# Altium schematic sheet 04-AUDIO.SchDoc
size C
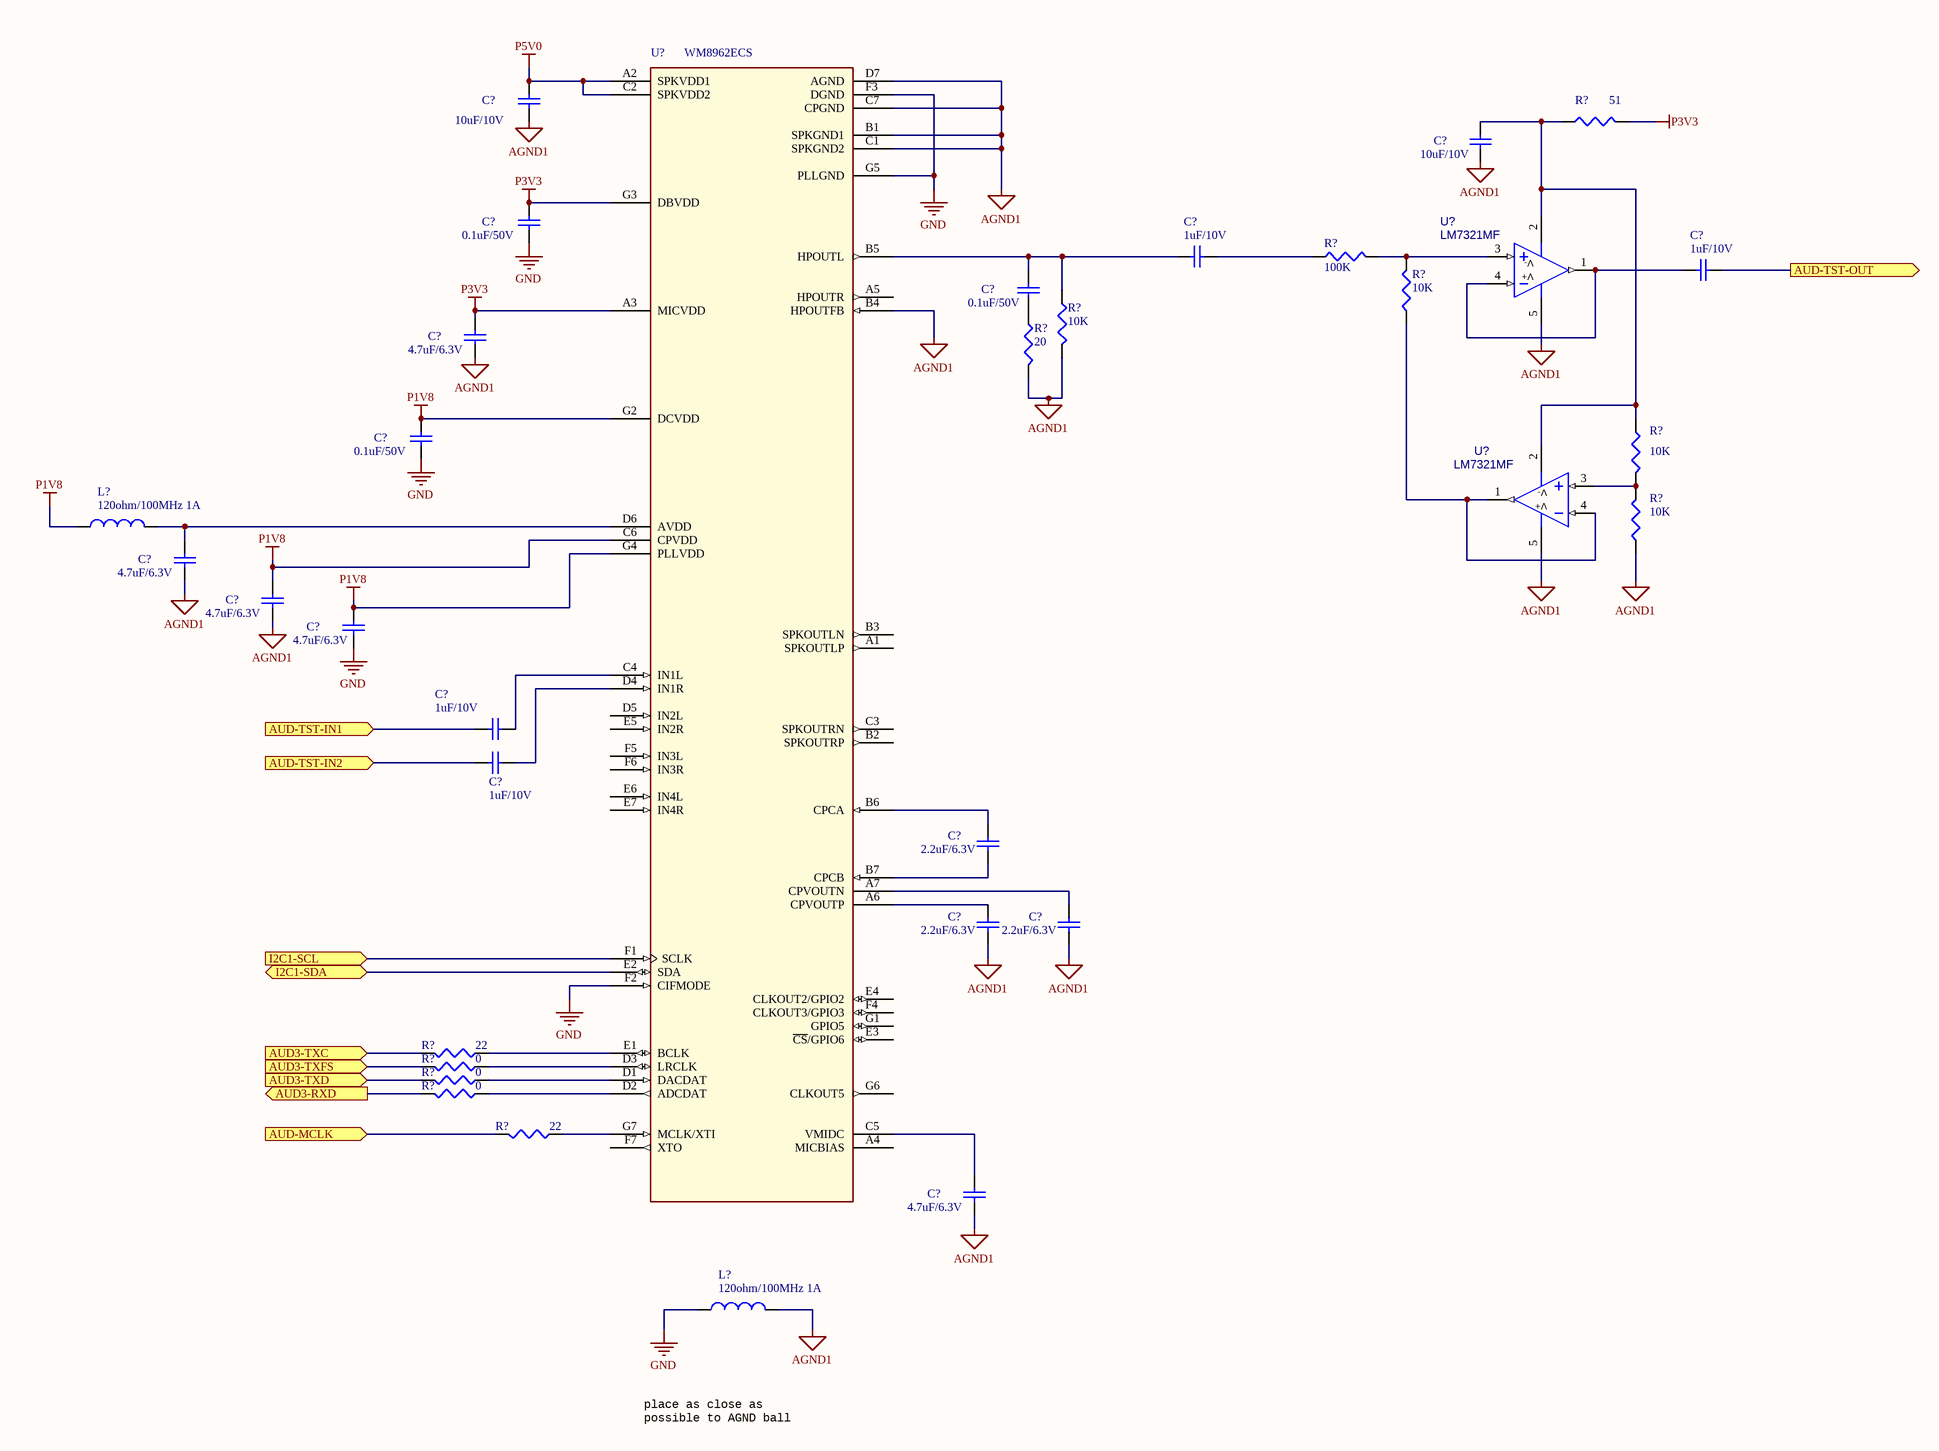
[diagram p0: 04-AUDIO.SchDoc]

## Parts
(Parts that share a designator on the sheet are numbered #1, #2 ... from top to bottom, then left to right.)
C?#1  10uF/10V  [0805]
C?#2  10uF/10V  [0805]
C?#3  0.1uF/50V  [0402]
C?#4  1uF/10V  [0402]
C?#5  1uF/10V  [0402]
C?#6  0.1uF/50V  [0402]
C?#7  4.7uF/6.3V  [0603]
C?#8  0.1uF/50V  [0402]
C?#9  4.7uF/6.3V  [0603]
C?#10  4.7uF/6.3V  [0603]
C?#11  4.7uF/6.3V  [0603]
C?#12  1uF/10V  [0402]
C?#13  1uF/10V  [0402]
C?#14  2.2uF/6.3V  [0402]
C?#15  2.2uF/6.3V  [0402]
C?#16  2.2uF/6.3V  [0402]
C?#17  4.7uF/6.3V  [0603]
L?#1  120ohm/100MHz 1A  [0603]
L?#2  120ohm/100MHz 1A  [0603]
R?#1  51  [0402]
R?#2  100K  [0402]
R?#3  10K  [0402]
R?#4  10K  [0402]
R?#5  20  [0402]
R?#6  10K  [0402]
R?#7  10K  [0402]
R?#8  22  [0402]
R?#9  0  [0402]
R?#10  0  [0402]
R?#11  0  [0402]
R?#12  22  [0402]
U?#1  WM8962ECS  [BGA49]
U?#2  LM7321MF  [SOT23-5]
U?#3  LM7321MF  [SOT23-5]

## Ports
AUD3-RXD (out), AUD3-TXC (in), AUD3-TXD (in), AUD3-TXFS (in), AUD-MCLK (in), AUD-TST-IN1 (in), AUD-TST-IN2 (in), AUD-TST-OUT (out), I2C1-SCL (in), I2C1-SDA (bidir)

## Nets
AGND1: C?#1.1 C?#2.2 C?#7.1 C?#9.1 C?#10.1 C?#15.1 C?#16.1 C?#17.1 L?#2.2 R?#3.2 R?#5.2 R?#7.1 U?#1.B1(SPKGND1) U?#1.B4(HPOUTFB) U?#1.C1(SPKGND2) U?#1.C7(CPGND) U?#1.D7(AGND) U?#2.5(V+) U?#3.5(V+)
GND: C?#3.1 C?#8.1 C?#11.1 L?#2.1 U?#1.F2(CIFMODE) U?#1.F3(DGND) U?#1.G5(PLLGND)
P1V8: C?#8.2 C?#10.2 C?#11.2 L?#1.1 U?#1.C6(CPVDD) U?#1.G2(DCVDD) U?#1.G4(PLLVDD)
P3V3: C?#3.2 C?#7.2 R?#1.2 U?#1.A3(MICVDD) U?#1.G3(DBVDD)
P5V0: C?#1.2 U?#1.A2(SPKVDD1) U?#1.C2(SPKVDD2)
AUD3-RXD: R?#11.2 ; port AUD3-RXD
AUD3-TXC: R?#8.2 ; port AUD3-TXC
AUD3-TXD: R?#10.2 ; port AUD3-TXD
AUD3-TXFS: R?#9.2 ; port AUD3-TXFS
AUD-MCLK: R?#12.2 ; port AUD-MCLK
AUD-TST-IN1: C?#12.2 ; port AUD-TST-IN1
AUD-TST-IN2: C?#13.2 ; port AUD-TST-IN2
AUD-TST-OUT: C?#5.1 ; port AUD-TST-OUT
I2C1-SCL: U?#1.F1(SCLK) ; port I2C1-SCL
I2C1-SDA: U?#1.E2(SDA) ; port I2C1-SDA
NetC?#2_1: C?#2.1 R?#1.1 R?#6.1 U?#2.2(V-) U?#3.2(V-)
NetC?#4_1: C?#4.1 R?#2.1
NetC?#4_2: C?#4.2 C?#6.2 R?#3.1 U?#1.B5(HPOUTL)
NetC?#5_2: C?#5.2 U?#2.1(OUT) U?#2.4(IN-)
NetC?#6_1: C?#6.1 R?#5.1
NetC?#9_2: C?#9.2 L?#1.2 U?#1.D6(AVDD)
NetC?#12_1: C?#12.1 U?#1.C4(IN1L)
NetC?#13_1: C?#13.1 U?#1.D4(IN1R)
NetC?#14_1: C?#14.1 U?#1.B7(CPCB)
NetC?#14_2: C?#14.2 U?#1.B6(CPCA)
NetC?#15_2: C?#15.2 U?#1.A6(CPVOUTP)
NetC?#16_2: C?#16.2 U?#1.A7(CPVOUTN)
NetC?#17_2: C?#17.2 U?#1.C5(VMIDC)
NetR?#2_2: R?#2.2 R?#4.2 U?#2.3(IN+)
NetR?#4_1: R?#4.1 U?#3.1(OUT) U?#3.4(IN-)
NetR?#6_2: R?#6.2 R?#7.2 U?#3.3(IN+)
NetR?#8_1: R?#8.1 U?#1.E1(BCLK)
NetR?#9_1: R?#9.1 U?#1.D3(LRCLK)
NetR?#10_1: R?#10.1 U?#1.D1(DACDAT)
NetR?#11_1: R?#11.1 U?#1.D2(ADCDAT)
NetR?#12_1: R?#12.1 U?#1.G7(MCLK/XTI)

Not connected (* = marked no-connect by the designer): U?#1 A1(SPKOUTLP) A4(MICBIAS) A5(HPOUTR) B2(SPKOUTRP) B3(SPKOUTLN) C3(SPKOUTRN) D5(IN2L) E3(~{CS}/GPIO6) E4(CLKOUT2/GPIO2) E5(IN2R) E6(IN4L) E7(IN4R) F4(CLKOUT3/GPIO3) F5(IN3L) F6(IN3R) F7(XTO) G1(GPIO5) G6(CLKOUT5)

## Notes on the sheet
- place as close as
  possible to AGND ball

## Library data of the parts
C?#1-C?#17 = Cap: Capacitor; Published: 8-Jun-2000; LatestRevisionDate: 17-Jul-2002; LatestRevisionNote: Re-released for DXP Platform.; PackageReference: RAD-0.3; Publisher: Altium Limited; PackageDescription: Radial Cap, Thru-Hole; 2 Leads; 0.3 in Pin Spacing
L?#1 L?#2 = Inductor: Code_IEC: 1005; Value: 300ohm/100MHz BEAD; Published: 8-Jun-2000; LatestRevisionDate: 29-May-2009; LatestRevisionNote: IPC-7351 Footprint Added.; PackageReference: 0402-A; Publisher: Altium Limited; PackageDescription: Chip Inductor; Code_JEITA: 0402
R?#1-R?#12 = CR16-1003FM
U?#1 = WM8962_BGA_49P_CUST: IC AUDIO CODEC 24BIT DAC 2 CH ADC 1.8V BGA49; AGILE_PN: 315-79434; MFG_NAME01: WOLFSON MICROELECTRONICS; MFG_PN01: WM8962ECSN/R; CAD_APPROVED: Yes; FPLIST: bga49_0p5_3p62x4,bga49_0p5_3p62x4_smdp; CLASS: IC; ROHS: Yes; HEIGHT: 0.75MM
U?#2 U?#3 = LM7321MF: Single 30V High Output Current and Unlimited Capacitive Load Op Amp; Manufacturer: National Semiconductor; Characteristics: LM7321MF Single 30V High Output Current and Unlimited Capacitive Load Op Amp; CompType: OpAmp IC; TaMin_C: -40.0; TaMax_C: 125.0; PowerWise: Y; SymbolVersion: 2008-07-09; PartNumber: LM7321MF; Value: LM7321MF; PackageDescription: 5 Lead SOT-23; PackageReference: MF05A_L; MountType: SMT; RoHS: O; ComponentLink1Description: LM7321 Datasheet; ComponentLink1URL: http://www.ti.com/lit/gpn/LM7321; ComponentLink2Description: LM7321 Web Page; ComponentLink2URL: http://www.ti.com/product/LM7321; ComponentLink3Description: MF05A Package Web Page; ComponentLink3URL: http://www.national.com/packaging/folders/mf05a.html; Version: B1.743; LatestRevisionDate: 2012-11-01; LatestRevisionNote: Mass Update; Publisher: National Semiconductor; Published: 2012-11-01